# Altium schematic sheet Master.SchDoc
size A4
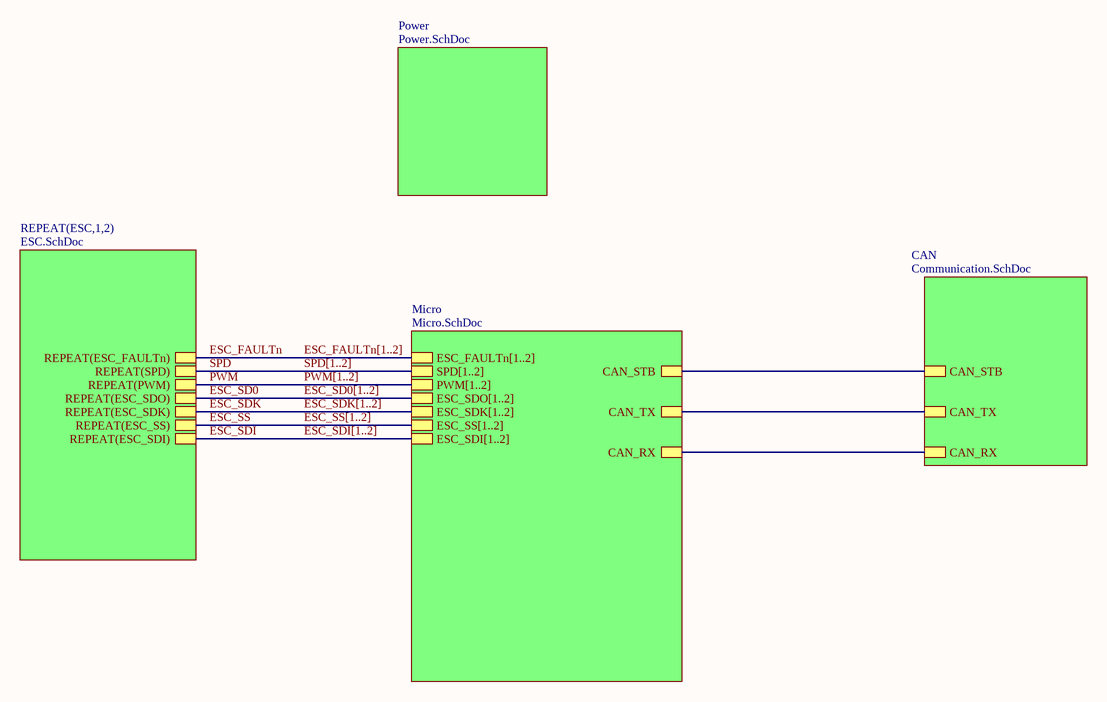
[diagram p0: Master.SchDoc]

## Sub-sheets
CAN = Communication.SchDoc: CAN_STB, CAN_TX, CAN_RX
Micro = Micro.SchDoc: CAN_RX, CAN_TX, CAN_STB, ESC_FAULTn[1..2], SPD[1..2], PWM[1..2], ESC_SDO[1..2], ESC_SDK[1..2], ESC_SS[1..2], ESC_SDI[1..2]
Power = Power.SchDoc: no entries
REPEAT(ESC,1,2) = ESC.SchDoc: REPEAT(ESC_FAULTn), REPEAT(SPD), REPEAT(PWM), REPEAT(ESC_SDO), REPEAT(ESC_SDK), REPEAT(ESC_SS), REPEAT(ESC_SDI)

## Nets
ESC_FAULTn: sheet REPEAT(ESC,1,2)/REPEAT(ESC_FAULTn)  [also labelled ESC_FAULTn[1..2]]
ESC_SD0: sheet REPEAT(ESC,1,2)/REPEAT(ESC_SDO)  [also labelled ESC_SD0[1..2]]
ESC_SDI: sheet REPEAT(ESC,1,2)/REPEAT(ESC_SDI)  [also labelled ESC_SDI[1..2]]
ESC_SDK: sheet REPEAT(ESC,1,2)/REPEAT(ESC_SDK)  [also labelled ESC_SDK[1..2]]
ESC_SS: sheet REPEAT(ESC,1,2)/REPEAT(ESC_SS)  [also labelled ESC_SS[1..2]]
PWM: sheet REPEAT(ESC,1,2)/REPEAT(PWM)  [also labelled PWM[1..2]]
SPD: sheet REPEAT(ESC,1,2)/REPEAT(SPD)  [also labelled SPD[1..2]]
(unnamed): sheet CAN/CAN_STB, sheet Micro/CAN_STB
(unnamed): sheet CAN/CAN_TX, sheet Micro/CAN_TX
(unnamed): sheet CAN/CAN_RX, sheet Micro/CAN_RX